# EAGLE design KalamBoard (EAGLE 7.7.0)
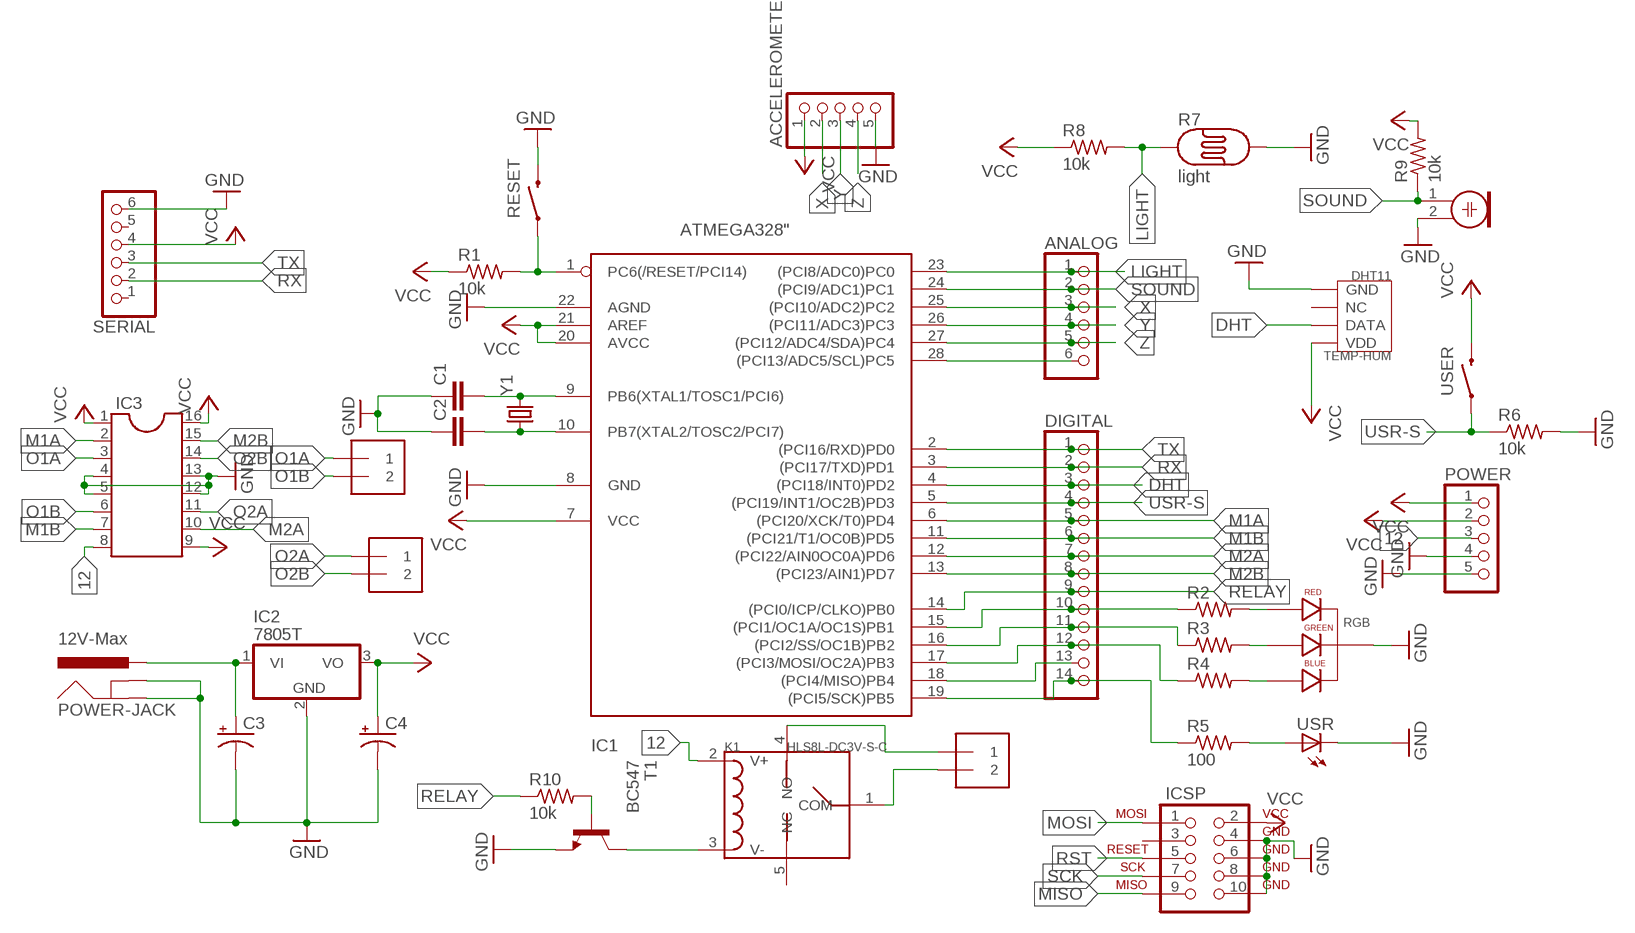
[diagram p0: schematic, sheet 1]

## Parts
ACCELEROMETER  PINHD-1X5  [1X05]
ANALOG  PINHD-1X6  [1X06]
C1  0.1UF-50V-20%(PTH)KIT-EZ  [CAP-PTH-SMALL-KIT]
C2  0.1UF-50V-20%(PTH)KIT-EZ  [CAP-PTH-SMALL-KIT]
C3  10UF-25V-20%(PTH)  [CPOL-RADIAL-10UF-25V]
C4  10UF-25V-20%(PTH)  [CPOL-RADIAL-10UF-25V]
DIGITAL  PINHD-1X14  [1X14]
IC1  ATMEGA328"  [ATMEGA328]
IC2  7805T  [TO220H]
IC3  DIL16S  [SOCKET-16]
ICSP  AVR_SPI_PROG2PTH  [AVR_ICSP]
K1  HLS8L-DC3V-S-C  RELAY-HLS8L-DC3V-S-C(5P-19X15MM)  [REY5-19.0X15.0X15.0MM]
MOTOR1  1X2-3.5MM  [1X2-3.5MM]
MOTOR2  1X2-3.5MM  [1X2-3.5MM]
POWER  PINHD-1X5  [1X05]
POWER-JACK  12V-Max  POWER_JACK"  [POWER_JACK]
R1  10k  RESISTOR1/6WATT  [RESISTOR]
R2  RESISTOR1/6WATT  [RESISTOR]
R3  RESISTOR1/6WATT  [RESISTOR]
R4  RESISTOR1/6WATT  [RESISTOR]
R5  100  RESISTOR1/6WATT  [RESISTOR]
R6  10k  RESISTOR1/6WATT  [RESISTOR]
R7  light  PHOTOCELLPTH  [PHOTOCELL]
R8  10k  RESISTOR1/6WATT  [RESISTOR]
R9  10k  RESISTOR1/6WATT  [RESISTOR]
R10  10k  RESISTOR1/6WATT  [RESISTOR]
RELAY  1X2-3.5MM  [1X2-3.5MM]
RESET  MOMENTARY_SWITCH"  [MOMENTARY_SWITCH]
RGB  LED-RGB-CC-THRUDIFFUSE  [LED-RGB-THRU]
SERIAL  PINHD-1X6  [1X06]
SOUND  ELECTRET_MICROPHON-F6050AP  [F6050AP]
T1  BC547  [TO92]
TEMP-HUM  DHT11  TEM-HUM-DHT11(4P-15.5X12.0MM)  [SNR4-2.54-15.5X12.0X5.5MM]
USER  MOMENTARY_SWITCH"  [MOMENTARY_SWITCH]
USR  LED3MM  [LED]
Y1  CRYSTALHC49US  [HC49US]

## Nets
12: C3.1(+) IC2.1(VI) IC3.8 K1.2(V+) POWER-JACK.PWR POWER.3
DHT: DIGITAL.3 IC1.4((PCI18/INT0)PD2) TEMP-HUM.2(DATA)
GND: ACCELEROMETER.5 C1.1 C2.1 C3.2(-) C4.2(-) IC1.8(GND) IC1.22(AGND) IC2.2(GND) IC3.4 IC3.5 IC3.12 IC3.13 ICSP.4(GND) ICSP.6(GND) ICSP.8(GND) ICSP.10(GND) POWER-JACK.GND POWER-JACK.GNDBREAK POWER.4 POWER.5 R6.2 R7.2 RESET.3 RGB.2(CATHODE) SERIAL.6 SOUND.2 T1.1(E) TEMP-HUM.4(GND) USR.K(C)
LIGHT: ANALOG.1 IC1.23((PCI8/ADC0)PC0) R7.1 R8.2
M1A: DIGITAL.5 IC1.6((PCI20/XCK/T0)PD4) IC3.2
M1B: DIGITAL.6 IC1.11((PCI21/T1/OC0B)PD5) IC3.7
M2A: DIGITAL.7 IC1.12((PCI22/AIN0OC0A)PD6) IC3.10
M2B: DIGITAL.8 IC1.13((PCI23/AIN1)PD7) IC3.15
MISO: DIGITAL.13 IC1.18((PCI4/MISO)PB4) ICSP.9(MISO)
MOSI: DIGITAL.12 IC1.17((PCI3/MOSI/OC2A)PB3) ICSP.1(MOSI) R4.1
N$2: C1.2 IC1.9(PB6(XTAL1/TOSC1/PCI6)) Y1.2
N$3: C2.2 IC1.10(PB7(XTAL2/TOSC2/PCI7)) Y1.1
N$4: R10.2 T1.2(B)
N$5: K1.3(V-) T1.3(C)
N$6: K1.4(NO) RELAY.1
N$10: ANALOG.6 IC1.28((PCI13/ADC5/SCL)PC5)
N$13: K1.1(COM) RELAY.2
N$20: DIGITAL.10 IC1.15((PCI1/OC1A/OC1S)PB1) R2.1
N$21: DIGITAL.11 IC1.16((PCI2/SS/OC1B)PB2) R3.1
N$25: R2.2 RGB.1(RED_CATHODE)
N$26: R3.2 RGB.3(GREEN_CATHODE)
N$27: R4.2 RGB.4(BLUE_CATHODE)
N$29: R5.2 USR.A
O1A: IC3.3 MOTOR1.1
O1B: IC3.6 MOTOR1.2
O2A: IC3.11 MOTOR2.1
O2B: IC3.14 MOTOR2.2
RELAY: DIGITAL.9 IC1.14((PCI0/ICP/CLKO)PB0) R10.1
RST: IC1.1(PC6(/RESET/PCI14)) ICSP.5(RESET) R1.2 RESET.1
RX: DIGITAL.2 IC1.3((PCI17/TXD)PD1) SERIAL.2
SCK: DIGITAL.14 IC1.19((PCI5/SCK)PB5) ICSP.7(SCK) R5.1
SOUND: ANALOG.2 IC1.24((PCI9/ADC1)PC1) R9.1 SOUND.1
TX: DIGITAL.1 IC1.2((PCI16/RXD)PD0) SERIAL.3
USR-S: DIGITAL.4 IC1.5((PCI19/INT1/OC2B)PD3) R6.1 USER.1
VCC: ACCELEROMETER.1 C4.1(+) IC1.7(VCC) IC1.20(AVCC) IC1.21(AREF) IC2.3(VO) IC3.1 IC3.9 IC3.16 ICSP.2(VCC) POWER.1 POWER.2 R1.1 R8.1 R9.2 SERIAL.4 TEMP-HUM.1(VDD) USER.3
X: ACCELEROMETER.2 ANALOG.3 IC1.25((PCI10/ADC2)PC2)
Y: ACCELEROMETER.3 ANALOG.4 IC1.26((PCI11/ADC3)PC3)
Z: ACCELEROMETER.4 ANALOG.5 IC1.27((PCI12/ADC4/SDA)PC4)
Unconnected: ICSP.3(NC) K1.5(NC) SERIAL.1 SERIAL.5 TEMP-HUM.3(NC)

## Library data of the parts
ACCELEROMETER POWER = pinhead:PINHD-1X5: PIN HEADER
ANALOG SERIAL = pinhead:PINHD-1X6: PIN HEADER
C1 C2 = SparkFun-Capacitors:0.1UF-50V-20%(PTH): CAP-08370; PROD_ID: CAP-08370
C3 C4 = SparkFun-Capacitors:10UF-25V-20%(PTH): CAP-08440; PROD_ID: CAP-08440
DIGITAL = pinhead:PINHD-1X14: PIN HEADER
IC1 = RBBB:ATMEGA328: MICROCONTROLLER 16 kBytes FLASH 1 kBytes SRAM 512 Bytes EEPROM USART 8-channel 10 bit ADC
IC2 = adafruit:78*: Positive VOLTAGE REGULATOR Added bigger pads to the TO-92 package
IC3 = ic-package:DIL16: Dual In Line / Socket
ICSP = SparkFun-Connectors:AVR_SPI_PROG2: AVR 10-pin ICSP Header This is the standard AVR In Circuit Serial Programming header. Minimal, but includes pin one indicator. Works with standard Olimex programmers. Also look for the 6-pin reduced version. Spark Fun Electronics SKU: PRT-00778
K1 = Seeed-Relay-2016:RELAY-HLS8L-DC3V-S-C(5P-19X15MM): 315030009; MPN: HLS8L-DC3V-S-C
MOTOR1 MOTOR2 RELAY = adafruit:1X2: 3.5mm Terminal block http://www.ladyada.net/library/pcb/eaglelibrary.html
POWER-JACK = RBBB:POWER_JACK: Power Jack This is the standard 5.5mm barrel jack for power. The PTH is the most common, proven, reliable, footprint. All others are experimental. The Slot footprint only works if the mill layer is transmitted to the PCB fab house so be warned. Spark Fun Electronics SKU : PRT-00119. Mating wall wart : TOL-00298 (and others)
R1-R6 R8-R10 = RBBB:RESISTOR: RESISTOR, American symbol
R7 = SparkFun-Sensors:PHOTOCELL: CdS photoresistor. This is a low cost way to detect light levels. Resistance decreases with more incoming light. SparkFun SKU: SEN-09088
RESET USER = RBBB:MOMENTARY_SWITCH
RGB = SparkFun-LED:LED-RGB-CC-THRU: RGB Through-hole common cathode LED SparkFun Storefront: COM-00105 (Clear) COM-09264 (Diffuse); PROD_ID: DIO-09434
SOUND = microphon:ELECTRET_MICROPHON-: Electret Condenser Microphone
T1 = transistor:BC547: NPN TRANSISTOR
TEMP-HUM = Seeed-Sensor-2016:TEM-HUM-DHT11(4P-15.5X12.0MM): 314010000; MPN: DHT11
USR = RBBB:LED: LED OSRAM: - CHIPLED LG R971, LG N971, LY N971, LG Q971, LY Q971, LO R971, LY R971 LH N974, LH R974 LS Q976, LO Q976, LY Q976 LO Q996 - Hyper CHIPLED LW Q18S LB Q993, LB Q99A, LB R99A - SideLED LS A670, LO A670, LY A670, LG A670, LP A670 LB A673, LV A673, LT A673, LW A673 LH A674 LY A675 LS A676, LA A676, LO A676, LY A676, LW A676 LS A679, LY A679, LG A679 - Hyper Micro SIDELED® LS Y876, LA Y876, LO Y876, LY Y876 LT Y87S - SmartLED LW L88C, LW L88S LB L89C, LB L89S, LG L890 LS L89K, LO L89K, LY L89K LS L896, LA L896, LO L896, LY L896 - TOPLED LS T670, LO T670, LY T670, LG T670, LP T670 LSG T670, LSP T670, LSY T670, LOP T670, LYG T670 LG T671, LOG T671, LSG T671 LB T673, LV T673, LT T673, LW T673 LH T674 LS T676, LA T676, LO T676, LY T676, LB T676, LH T676, LSB T676, LW T676 LB T67C, LV T67C, LT T67C, LS T67K, LO T67K, LY T67K, LW E67C LS E67B, LA E67B, LO E67B, LY E67B, LB E67C, LV E67C, LT E67C LW T67C LS T679, LY T679, LG T679 LS T770, LO T770, LY T770, LG T770, LP T770 LB T773, LV T773, LT T773, LW T773 LH T774 LS E675, LA E675, LY E675, LS T675 LS T776, LA T776, LO T776, LY T776, LB T776 LHGB T686 LT T68C, LB T68C - Hyper Mini TOPLED® LB M676 - Mini TOPLED Santana® LG M470 LS M47K, LO M47K, LY M47K Source: http://www.osram.convergy.de LUXEON: - LUMILED® LXK2-PW12-R00, LXK2-PW12-S00, LXK2-PW14-U00, LXK2-PW14-V00 LXK2-PM12-R00, LXK2-PM12-S00, LXK2-PM14-U00 LXK2-PE12-Q00, LXK2-PE12-R00, LXK2-PE12-S00, LXK2-PE14-T00, LXK2-PE14-U00 LXK2-PB12-K00, LXK2-PB12-L00, LXK2-PB12-M00, LXK2-PB14-N00, LXK2-PB14-P00, LXK2-PB14-Q00 LXK2-PR12-L00, LXK2-PR12-M00, LXK2-PR14-Q00, LXK2-PR14-R00 LXK2-PD12-Q00, LXK2-PD12-R00, LXK2-PD12-S00 LXK2-PH12-R00, LXK2-PH12-S00 LXK2-PL12-P00, LXK2-PL12-Q00, LXK2-PL12-R00 Source: www.luxeon.com KINGBRIGHT: KA-3528ASYC Source: www.kingbright.com
Y1 = SparkFun-FreqCtrl:CRYSTAL: Various standard crystals. Proven footprints.

## Net classes
0 default: width 0.305 mm, drill 0.508 mm, clearance 0.254 mm

## Board
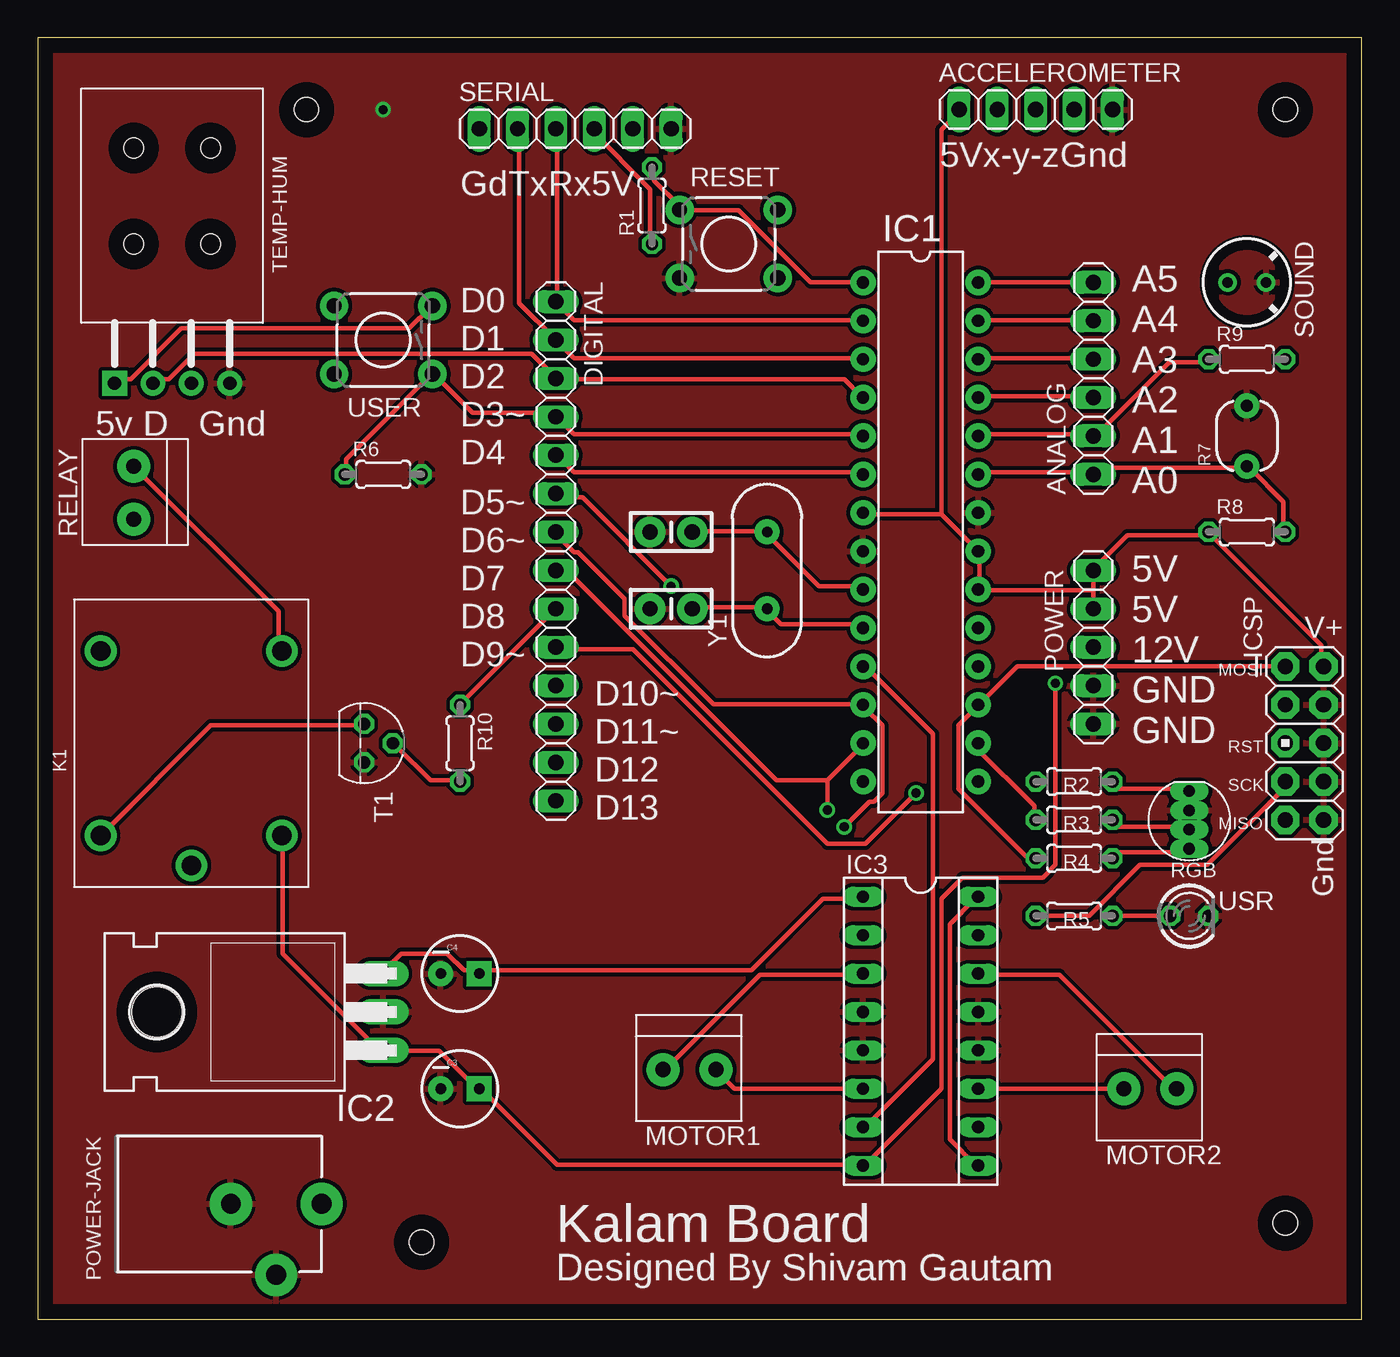
[diagram p1: board, top side]
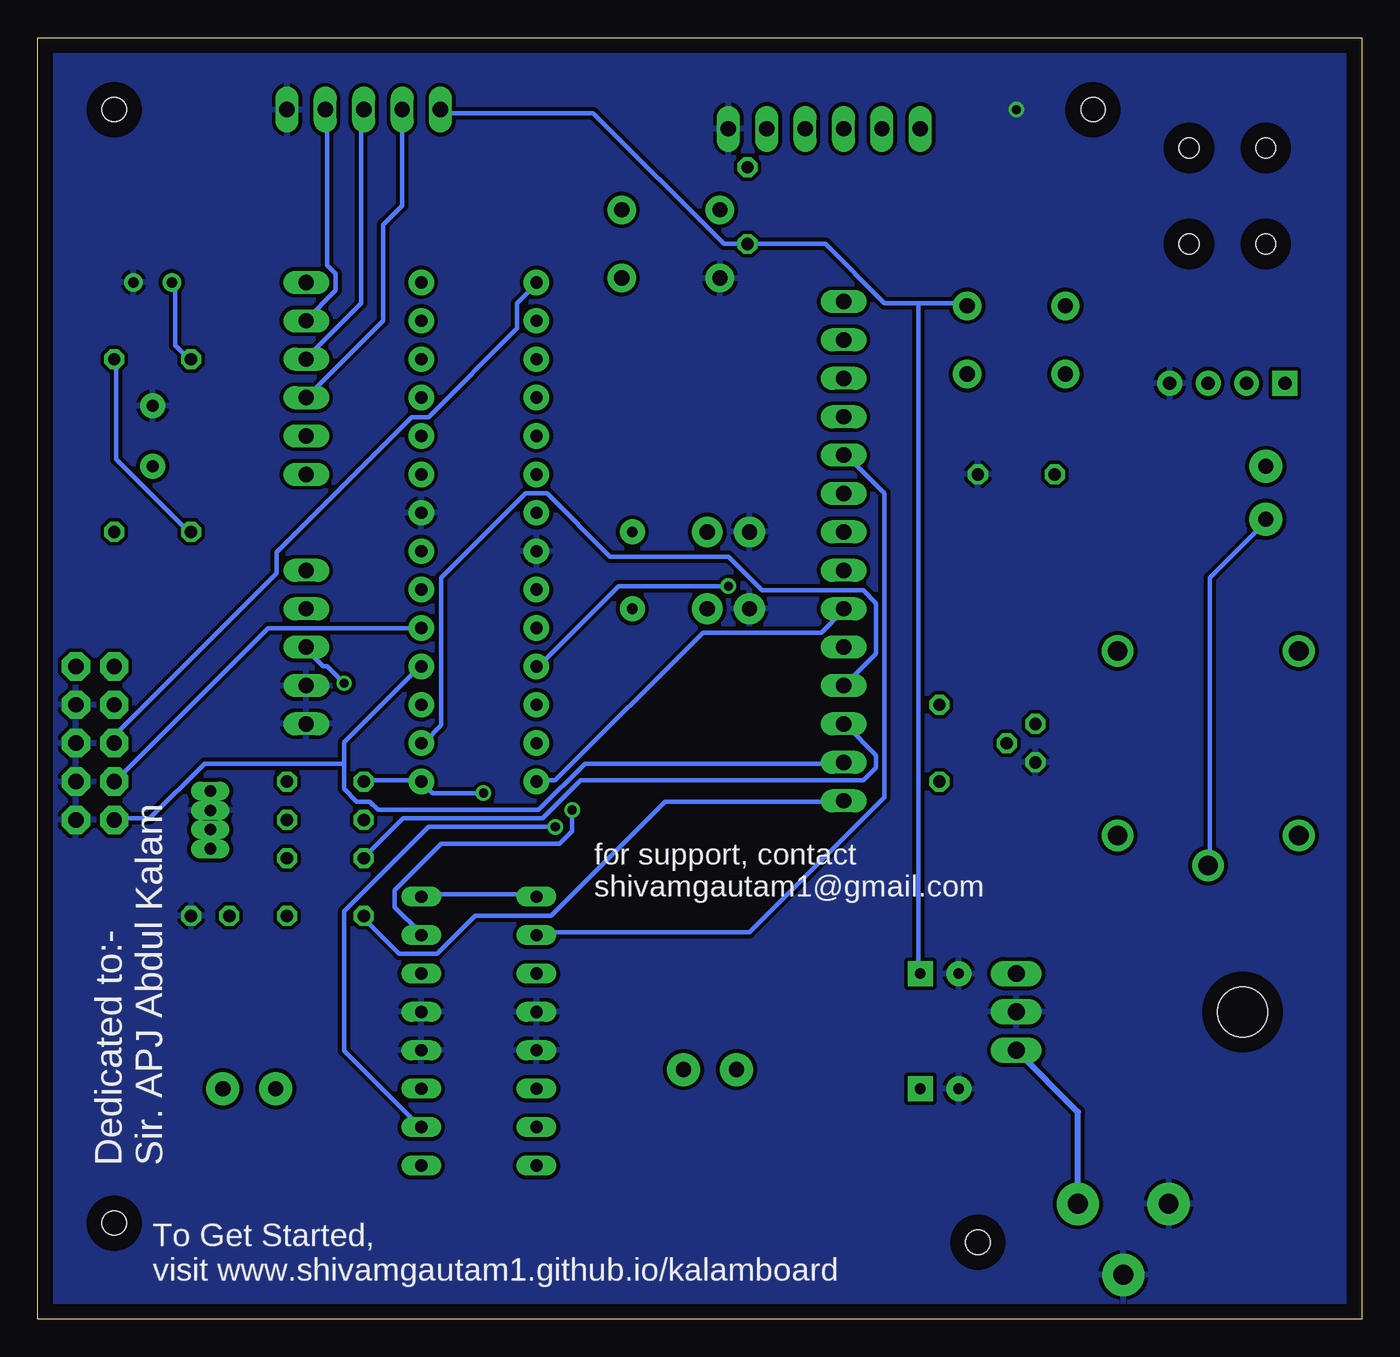
[diagram p2: board, bottom side, seen from below]

Size 87.61 x 84.76 mm. Coordinates in mm from the lower left corner, seen from the top.
Outline: 0,0 87.61,0 87.61,84.76 0,84.76 0,0
Copper layers (1*16): Top 0.035mm / dielectric 1.5mm / Bottom 0.035mm
Design rules "default": minimum track width 10mil, minimum drill 24mil, track to track 8mil, track to pad 8mil, pad to pad 8mil, via to via 8mil, smd to smd 8mil, copper to edge 40mil, drill to drill 8mil, minimum pad ring 10mil, minimum via ring 8mil, stop-mask expansion 4mil, vias tented up to drill 0mil, thermal gap 10mil
Holes 1.6 mm at 82.55,6.35 82.55,80.01 25.4,5.08 17.78,80.01
Holes 1.3 mm at 6.35,77.47 11.43,77.47 6.35,71.12 11.43,71.12

### Footprints (pad centres in the part's own frame; a part is rotated, then mirrored left to right if it is on the bottom)
1X05 = drill 1.016 long: 1 -5.08,0; 2 -2.54,0; 3 0,0; 4 2.54,0; 5 5.08,0
1X06 = drill 1.016 long: 1 -6.35,0; 2 -3.81,0; 3 -1.27,0; 4 1.27,0; 5 3.81,0; 6 6.35,0
CAP-PTH-SMALL-KIT = drill 1.016 pad 2.032: 1 -1.397,0; 2 1.397,0
CPOL-RADIAL-10UF-25V = drill 0.7 pad 1.651 square: 1 1.27,0 | drill 0.7 pad 1.651: 2 -1.27,0
1X14 = drill 1.016 long: 1 -16.51,0; 2 -13.97,0; 3 -11.43,0; 4 -8.89,0; 5 -6.35,0; 6 -3.81,0; 7 -1.27,0; 8 1.27,0; 9 3.81,0; 10 6.35,0; 11 8.89,0; 12 11.43,0; 13 13.97,0; 14 16.51,0
ATMEGA328 = drill 0.813 pad 1.676: 1 -16.51,-3.81; 2 -13.97,-3.81; 3 -11.43,-3.81; 4 -8.89,-3.81; 5 -6.35,-3.81; 6 -3.81,-3.81; 7 -1.27,-3.81; 8 1.27,-3.81; 9 3.81,-3.81; 10 6.35,-3.81; 11 8.89,-3.81; 12 11.43,-3.81; 13 13.97,-3.81; 14 16.51,-3.81; 15 16.51,3.81; 16 13.97,3.81; 17 11.43,3.81; 18 8.89,3.81; 19 6.35,3.81; 20 3.81,3.81; 21 1.27,3.81; 22 -1.27,3.81; 23 -3.81,3.81; 24 -6.35,3.81; 25 -8.89,3.81; 26 -11.43,3.81; 27 -13.97,3.81; 28 -16.51,3.81
TO220H = drill 1.118 long: 1 -2.54,-10.16; 2 0,-10.16; 3 2.54,-10.16 | hole 3.302: 0,4.826
SOCKET-16 = drill 0.813 long: 1 -8.89,-3.81; 2 -6.35,-3.81; 3 -3.81,-3.81; 4 -1.27,-3.81; 5 1.27,-3.81; 6 3.81,-3.81; 7 6.35,-3.81; 8 8.89,-3.81; 9 8.89,3.81; 10 6.35,3.81; 11 3.81,3.81; 12 1.27,3.81; 13 -1.27,3.81; 14 -3.81,3.81; 15 -6.35,3.81; 16 -8.89,3.81
AVR_ICSP = drill 1.016 pad 1.88 octagon: 1 -1.27,5.08; 2 1.27,5.08; 3 -1.27,2.54; 4 1.27,2.54; 5 -1.27,0; 6 1.27,0; 7 -1.27,-2.54; 8 1.27,-2.54; 9 -1.27,-5.08; 10 1.27,-5.08
REY5-19.0X15.0X15.0MM = drill 1.3 pad 2.1: 1 -8.1,0; 2 -6.1,-6; 3 -6.1,6; 4 6.1,-6; 5 6.1,6
1X2-3.5MM = drill 1 pad 2.184: 1 1.8,0; 2 -1.7,0
POWER_JACK = drill 1.321 pad 2.794: GND 0,7.7; GNDBREAK 4.7,10.7; PWR 0,13.7
RESISTOR = drill 0.813 octagon: 1 -2.54,0; 2 2.54,0
PHOTOCELL = drill 0.8 pad 1.676: 1 -2,0; 2 2,0
MOMENTARY_SWITCH = drill 1.016 pad 1.88: 1 -3.251,2.261; 2 3.251,2.261; 3 -3.251,-2.261; 4 3.251,-2.261
LED-RGB-THRU = drill 0.762 pad 0.889 long: 1 1.905,0; 2 0.635,0; 3 -0.635,0; 4 -1.905,0
F6050AP = drill 0.7 pad 1.2: 1 0,1.27; 2 0,-1.27
TO92 = drill 0.813 octagon: 1 1.27,0; 2 0,1.905; 3 -1.27,0
SNR4-2.54-15.5X12.0X5.5MM = drill 0.889 pad 1.651 square: 1 -11.75,3.81 | drill 0.889 pad 1.651: 2 -11.75,1.27; 3 -11.75,-1.27; 4 -11.75,-3.81
LED = drill 0.813 octagon: A -1.27,0; K 1.27,0
HC49US = drill 0.7 pad 1.651: 1 -2.54,0; 2 2.54,0

### Placement (x,y rotation side)
ACCELEROMETER  66.04,80.01 0 top
ANALOG  69.85,62.23 90 top
C1  41.91,52.07 0 top
C2  41.91,46.99 0 top
C3  27.94,15.24 0 top
C4  27.94,22.86 0 top
DIGITAL  34.29,50.8 270 top
IC1  58.42,52.07 270 top
IC2  12.7,20.32 90 top
IC3  58.42,19.05 270 top
ICSP  83.82,38.1 0 top
K1  10.16,38.1 90 top
MOTOR1  43.18,16.51 180 top
MOTOR2  73.66,15.24 180 top
POWER  69.85,44.45 270 top
POWER-JACK  5.08,7.62 270 top
R1  40.64,73.66 90 top
R2  68.58,35.56 0 top
R3  68.58,33.02 0 top
R4  68.58,30.48 0 top
R5  68.58,26.67 0 top
R6  22.86,55.88 0 top
R7  80.01,58.42 90 top
R8  80.01,52.07 0 top
R9  80.01,63.5 0 top
R10  27.94,38.1 270 top
RELAY  6.35,54.61 90 top
RESET  45.72,71.12 0 top
RGB  76.2,33.02 90 top
SERIAL  35.56,78.74 0 top
SOUND  80.01,68.58 90 top
T1  21.59,38.1 270 top
TEMP-HUM  8.89,73.66 90 top
USER  22.86,64.77 180 top
USR  76.2,26.67 0 top
Y1  48.26,49.53 90 top

### Tracks (layer width: path | path; a pad name or v marks a point on that pad's centre or on a via)
12  (via drill 0.61)
  Top 0.305: v67.33,42.06 67.33,30.05 66.5,29.21 61.19,29.21 59.79,27.81 59.79,15.24 54.76,10.21 IC3.8 54.48,10.21 34.37,10.21 29.34,15.24 C3.1 29.06,15.24 26.54,17.75 22.91,17.75 IC2.1 22.63,17.75 16.2,24.18 16.2,31.72 K1.2
  Bottom 0.305: v67.33,42.06 68.45,43.18 68.73,43.18 69.85,44.3 POWER.3
  Bottom 0.406: POWER-JACK.PWR 18.78,13.7 IC2.1
DHT
  Top 0.305: IC1.4 54.48,61.06 53.37,62.18 34.37,62.18 DIGITAL.3 34.09,62.46 32.69,63.86 10.34,63.86 8.66,62.18 7.82,62.18 TEMP-HUM.2
GND  (via drill 0.6)
  other vias: 22.86,80.01
  pour Bottom: -1.27,86.36 -1.27,-1.27 88.9,-1.27 88.9,86.36
  pour Top: 0,85.09 0,0 87.63,0 87.63,85.09
LIGHT
  Top 0.305: R8.2 82.42,52.12 82.42,54.08 80.19,56.31 R7.1 79.91,56.31 70.13,56.31 69.85,56.03 | 69.85,56.03 62.31,56.03 IC1.23 | 69.85,56.03 ANALOG.1
M1A
  Top 0.305: IC1.6 54.48,56.03 35.48,56.03 34.37,57.15 DIGITAL.5
  Bottom 0.305: IC3.2 54.48,25.58 40.51,25.58 31.57,34.52 31.57,54.64 34.09,57.15 DIGITAL.5
M1B  (via drill 0.61)
  Top 0.305: IC3.7 54.76,12.72 59.23,17.2 59.23,38.71 54.76,43.18 IC1.11 | v41.91,48.49 36.04,54.36 34.37,54.36 DIGITAL.6
  Bottom 0.305: v41.91,48.49 49.17,48.49 54.48,43.18 IC1.11
M2A  (via drill 0.61)
  Top 0.305: v53.37,32.56 55.04,34.24 55.32,34.24 55.88,34.8 55.88,39.27 54.76,40.39 IC1.12 54.48,40.67 44.7,40.67 38.84,46.53 38.84,47.65 35.76,50.72 35.48,50.72 34.37,51.84 DIGITAL.7
  Bottom 0.305: v53.37,32.56 61.75,32.56 67.33,26.97 67.33,17.75 62.31,12.72 IC3.10
M2B  (via drill 0.61)
  Top 0.305: 52.25,35.64 v52.25,33.68 | 52.25,35.64 54.48,37.87 IC1.13 | 52.25,35.64 48.9,35.64 35.2,49.33 34.37,49.33 DIGITAL.8
  Bottom 0.305: v52.25,33.68 52.25,32.28 53.09,31.45 60.91,31.45 63.98,28.37 63.98,27.25 62.31,25.58 IC3.15
MISO
  Bottom 0.305: 67.33,36.75 67.33,38.15 62.31,43.18 IC1.18 | 67.33,36.75 67.33,35.08 66.5,34.24 65.66,34.24 65.1,33.68 54.48,33.68 51.41,36.75 34.37,36.75 DIGITAL.13 | 67.33,36.75 76.56,36.75 80.19,33.12 82.42,33.12 ICSP.9
MOSI
  Top 0.305: R4.1 65.94,30.61 65.38,30.61 60.91,35.08 60.91,39.27 62.03,40.39 IC1.17 62.31,40.67 64.82,43.18 ICSP.1
  Bottom 0.305: DIGITAL.12 34.09,39.27 32.13,37.31 32.13,36.47 32.97,35.64 51.69,35.64 54.2,33.12 63.42,33.12 65.94,30.61 R4.1
N$2
  Top 0.305: C1.2 43.31,52.12 48.06,52.12 Y1.2 48.34,51.84 51.69,48.49 54.48,48.49 IC1.9
N$3
  Top 0.305: C2.2 43.31,47.09 48.06,47.09 Y1.1 48.34,46.81 49.17,45.97 54.48,45.97 IC1.10
N$4
  Top 0.305: R10.2 27.94,35.64 25.98,35.64 23.75,37.87 T1.2
N$5
  Top 0.305: T1.3 21.51,39.27 11.46,39.27 4.19,32 K1.3
N$6
  Top 0.305: K1.4 15.93,44.3 15.93,46.81 6.43,56.31 RELAY.1
N$10
  Top 0.305: ANALOG.6 69.85,68.6 62.31,68.6 IC1.28
N$13
  Bottom 0.305: K1.1 10.06,30.05 10.06,49.05 6.43,52.68 RELAY.2
N$20  (via drill 0.61)
  Top 0.305: v58.12,34.8 54.76,31.45 52.25,31.45 39.4,44.3 34.37,44.3 DIGITAL.10
  Bottom 0.305: R2.1 65.94,35.64 62.31,35.64 IC1.15 61.47,34.8 v58.12,34.8
N$21
  Top 0.305: R3.1 65.94,33.12 65.94,33.96 62.03,37.87 IC1.16
  Bottom 0.305: DIGITAL.11 34.09,42.06 32.13,44.02 32.13,47.37 32.97,48.21 39.67,48.21 41.91,50.44 49.73,50.44 53.92,54.64 55.32,54.64 60.91,49.05 60.91,39.27 62.03,38.15 IC1.16
N$25
  Top 0.305: RGB.1 76,35.08 71.53,35.08 71.25,35.36 R2.2
N$26
  Top 0.305: RGB.3 76,32.56 71.53,32.56 71.25,32.84 R3.2
N$27
  Top 0.305: R4.2 71.53,30.89 76,30.89 RGB.4
N$29
  Top 0.305: R5.2 71.25,26.7 74.88,26.7 USR.A
O1A
  Top 0.305: IC3.3 54.48,22.78 47.78,22.78 41.63,16.64 MOTOR1.1
O1B
  Top 0.305: IC3.6 46.1,15.24 44.98,16.36 MOTOR1.2
O2A
  Top 0.305: MOTOR2.1 IC3.11
O2B
  Top 0.305: IC3.14 62.31,22.78 67.61,22.78 75.16,15.24 MOTOR2.2
RELAY
  Top 0.305: R10.1 27.94,40.67 34.09,46.81 DIGITAL.9
  Bottom 0.305: IC1.14 54.48,35.64 53.37,35.64 43.59,45.42 35.76,45.42 34.37,46.81 DIGITAL.9
RST
  Top 0.305: R1.2 40.79,76.15 40.79,75.31 42.47,73.63 RESET.1 42.47,73.35 46.38,73.35 51.13,68.6 54.48,68.6 IC1.1
  Bottom 0.305: ICSP.5 82.42,38.15 82.42,38.71 71.81,49.33 71.81,50.72 62.87,59.67 61.75,59.67 55.88,65.53 55.88,67.21 54.76,68.33 IC1.1
RX
  Top 0.305: SERIAL.2 31.85,78.66 31.85,67.21 DIGITAL.2 35.48,63.58 54.48,63.58 IC1.3
SCK
  Top 0.305: R5.1 66.22,26.7 69.57,26.7 72.92,30.05 77.39,30.05 82.7,35.36 ICSP.7
  Bottom 0.305: DIGITAL.14 34.37,34.24 46.1,34.24 53.65,26.7 58.67,26.7 61.19,24.18 63.7,24.18 65.94,26.42 R5.1 | IC1.19 62.31,45.7 72.36,45.7 82.42,35.64 ICSP.7
SOUND
  Top 0.305: IC1.24 62.31,58.55 69.85,58.55 ANALOG.2 69.85,58.27 74.88,63.3 77.39,63.3 R9.1
  Bottom 0.305: SOUND.1 78.51,68.33 78.51,64.41 77.67,63.58 R9.1
TX
  Top 0.305: SERIAL.3 34.37,78.66 34.37,67.49 DIGITAL.1 34.37,67.21 35.48,66.09 54.48,66.09 IC1.2
USR-S
  Top 0.305: R6.1 20.4,56.03 20.4,56.87 25.98,62.46 USER.1 26.26,62.46 28.78,59.94 34.09,59.94 DIGITAL.4 34.37,59.67 35.48,58.55 54.48,58.55 IC1.5
VCC
  Top 0.305: IC2.3 22.91,23.06 24.03,24.18 27.1,24.18 28.22,23.06 29.06,23.06 C4.1 29.34,23.06 47.22,23.06 51.97,27.81 54.48,27.81 IC3.1 | IC3.9 62.03,10.21 60.35,11.89 60.35,26.14 62.03,27.81 IC3.16 | 59.79,53.24 54.76,53.24 IC1.7 | 59.79,53.24 IC1.21 62.31,50.72 62.31,48.49 IC1.20 62.31,48.21 69.85,48.21 | 69.85,48.21 POWER.1 69.85,49.61 72.08,51.84 77.39,51.84 R8.1 77.67,51.84 84.94,44.58 84.94,43.18 ICSP.2 | 69.85,48.21 POWER.2 | TEMP-HUM.1 5.31,62.18 6.15,62.18 9.5,65.53 24.59,65.53 25.98,66.93 USER.3 | R1.1 40.51,71.12 40.51,74.75 36.6,78.66 SERIAL.4 | 59.79,53.24 59.79,78.66 60.91,79.78 ACCELEROMETER.1
  Bottom 0.305: IC3.1 54.76,28.09 62.03,28.09 IC3.16 | R9.2 82.42,63.3 82.42,56.87 77.67,52.12 R8.1 | ACCELEROMETER.1 60.91,79.78 50.85,79.78 42.19,71.12 R1.1 35.48,71.12 31.57,67.21 29.34,67.21 | 29.34,67.21 26.26,67.21 USER.3 | 29.34,67.21 29.34,23.06 C4.1
X
  Top 0.305: ANALOG.3 69.85,61.06 62.31,61.06 IC1.25
  Bottom 0.305: ACCELEROMETER.2 63.5,73.66 64.77,72.39 64.77,66.04 ANALOG.3
Y
  Top 0.305: ANALOG.4 69.85,63.58 62.31,63.58 IC1.26
  Bottom 0.305: ACCELEROMETER.3 66.22,79.78 66.22,67.21 69.85,63.58 ANALOG.4
Z
  Top 0.305: ANALOG.5 69.85,66.09 62.31,66.09 IC1.27
  Bottom 0.305: ACCELEROMETER.4 68.45,79.78 68.45,69.72 67.89,69.16 67.89,68.05 69.85,66.09 ANALOG.5

### Text on the board
tPlace: 5Vx-y-zGnd | GdTxRx5V | 5v D Gnd | D0 / D1 / D2 / D3~ / D4 | A5 / A4 / A3 / A2 / A1 / A0 | V+ | MOSI | D5~ / D6~ / D7 / D8 / D9~ | 5V / 5V / 12V / GND / GND | RST | SCK | D10~ / D11~ / D12 / D13 | MISO | RGB | Gnd | Kalam Board | Designed By Shivam Gautam
bPlace: for support, contact / shivamgautam1@gmail.com | Dedicated to:- / Sir. APJ Abdul Kalam | To Get Started, / visit www.shivamgautam1.github.io/kalamboard